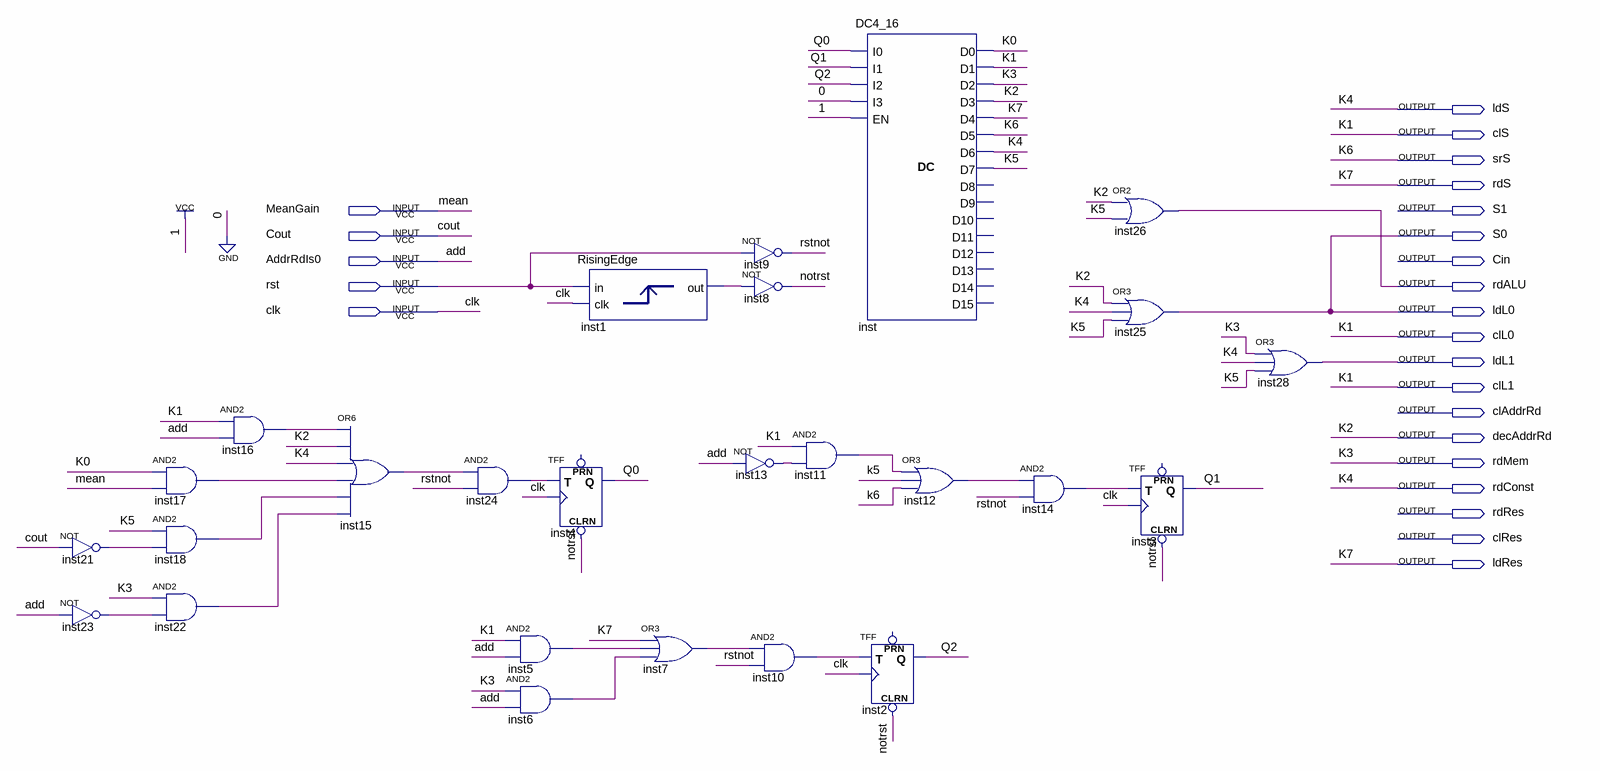
[diagram p0: schematic sheet]
// Quartus schematic MeanGain_upravljacka_jedinica.bdf as structural Verilog: 26 symbols, 24 pins
module MeanGain_upravljacka_jedinica (
  input  MeanGain,
  input  Cout,
  input  AddrRdIs0,
  input  rst,
  input  clk,
  output ldS,
  output clS,
  output srS,
  output rdS,
  output S1,
  output S0,
  output Cin,
  output rdALU,
  output ldL0,
  output clL0,
  output ldL1,
  output clL1,
  output clAddrRd,
  output decAddrRd,
  output rdMem,
  output rdConst,
  output rdRes,
  output clRes,
  output ldRes
);

  wire inst1_output, inst5_out, inst6_out, inst7_out, inst10_out, inst11_out, inst12_out, inst13_out,
       inst14_out, inst15_out, inst16_out, inst17_out, inst18_out, inst21_out, inst22_out, inst23_out,
       inst24_out, K0, K5, notrst, Q0, Q1, Q2, rstnot;

  not inst21 (inst21_out, Cout);
  not inst23 (inst23_out, AddrRdIs0);
  and inst17 (inst17_out, K0, MeanGain);
  and inst18 (inst18_out, K5, inst21_out);
  and inst22 (inst22_out, rdMem, inst23_out);
  and inst16 (inst16_out, clL0, AddrRdIs0);
  or inst15 (inst15_out, inst16_out, decAddrRd, ldS, inst17_out, inst18_out, inst22_out);
  and inst24 (inst24_out, inst15_out, rstnot);
  TFF inst4 (.CLRN(notrst), .T(inst24_out), .CLK(clk), .Q(Q0));  // open: PRN
  and inst5 (inst5_out, clL0, AddrRdIs0);
  and inst6 (inst6_out, rdMem, AddrRdIs0);
  RisingEdge inst1 (.clk(clk), .\input (rst), .\output (inst1_output));
  or inst7 (inst7_out, ldRes, inst5_out, inst6_out);
  not inst9 (rstnot, rst);
  not inst8 (notrst, inst1_output);
  not inst13 (inst13_out, AddrRdIs0);
  and inst10 (inst10_out, inst7_out, rstnot);
  and inst11 (inst11_out, clL0, inst13_out);
  DC4_16 inst (
    .I0(Q0), .I1(Q1), .I2(Q2), .I3(1'b0), .EN(1'b1), .D0(K0), .D1(clL0), .D2(rdMem), .D3(decAddrRd),
    .D4(ldRes), .D5(srS), .D6(ldS), .D7(K5));  // open: D8, D9, D10, D11, D12, D13, D14, D15
  TFF inst2 (.CLRN(notrst), .T(inst10_out), .CLK(clk), .Q(Q2));  // open: PRN
  or inst12 (inst12_out, inst11_out, K5, srS);
  and inst14 (inst14_out, inst12_out, rstnot);
  or inst26 (rdALU, decAddrRd, K5);
  or inst25 (ldL0, decAddrRd, ldS, K5);
  TFF inst3 (.CLRN(notrst), .T(inst14_out), .CLK(clk), .Q(Q1));  // open: PRN
  or inst28 (ldL1, rdMem, ldS, K5);

  assign clL1 = clL0;
  assign clS = clL0;
  assign rdConst = ldS;
  assign rdS = ldRes;
  assign S0 = ldL0;

  // Other names for the same wires on the sheet: add = AddrRdIs0; K1 = clL0; K2 = decAddrRd; K3 = rdMem; K4 = ldS;
  //   K6 = srS; K7 = ldRes; mean = MeanGain
endmodule
